# Altium schematic sheet Smart shoe_Power.SchDoc
size A; SheetNumber: 2; SheetTotal: 3
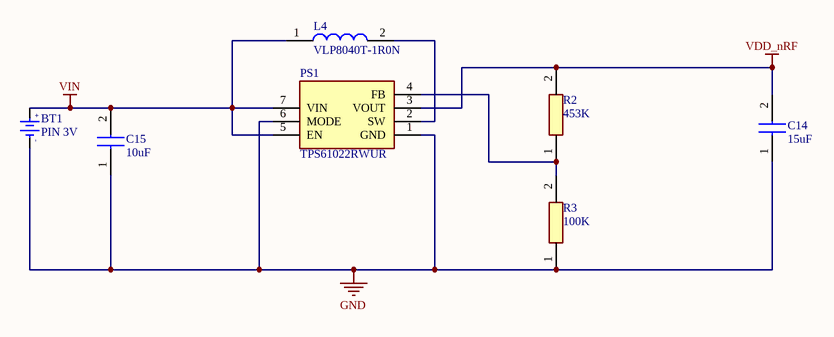
[diagram p0: Smart shoe_Power.SchDoc]

## Parts
BT1  PIN 3V  [PIN3V]
C14  15uF  [CAPC2012X145N]
C15  10uF  [CAPC2012X145N]
L4  VLP8040T-1R0N  [VLP8040T_1]
PS1  TPS61022RWUR  [TPS61022RWUR]
R2  453K  [RESC1005X40N]
R3  100K  [RESC1005X40N]

## Nets
GND: BT1.2(GND) C14.1 C15.1 PS1.1(GND) PS1.6(MODE) R3.1
VDD_nRF: C14.2 PS1.3(VOUT) R2.2
VIN: BT1.1(+3V) C15.2 L4.1 PS1.5(EN) PS1.7(VIN)
NetL4_2: L4.2 PS1.2(SW)
NetPS1_4: PS1.4(FB) R2.1 R3.2

## Notes on the sheet
- (in symbol PIN 3V) +; -

## Library data of the parts
BT1 = PIN 3V: Battery 3VDC; Value: PIN 3V
C14 = C2012X5R1V156M125AC: Capacitor; Manufacturer_Name: TDK; Datasheet Link: https://product.tdk.com/en/search/list#pn=C1608C0G1E103J080AA&site=FBNXDO0R&charset=UTF-8&group=tdk_pdc_en&design=producttdkcom-en&fromsyncsearch=1&_l=20&_p=1&_c=part_no-part_no&_d=667; Height: 0.75mm; Manufacturer_Part_Number: C2012X5R1V156M125AC; Mouser Part Number: 810-C2012X5R1V156M1C; Mouser Price/Stock: https://www.mouser.co.uk/ProductDetail/TDK/C2012X5R1V156M125AC?qs=xLDY6iXSiQZGpZ5eDP6b8w%3D%3D; Arrow Part Number: C2012X5R1V156M125AC; Arrow Price/Stock: https://www.arrow.com/en/products/c2012x5r1v156m125ac/tdk?region=nac
C15 = C0805C106K8PACTU: Capacitor; Manufacturer_Name: Kemet; Datasheet Link: https://www.arrow.com/en/products/c0805c106k8pactu/kemet-corporation; Height: 1.4mm; Manufacturer_Part_Number: C0805C106K8PACTU; Mouser Part Number: 80-C0805C106K8P; Mouser Price/Stock: https://www.mouser.co.uk/ProductDetail/KEMET/C0805C106K8PACTU?qs=Zpyg6gQUYs39C21BeavaKA%3D%3D; Arrow Part Number: C0805C106K8PACTU; Arrow Price/Stock: https://www.arrow.com/en/products/c0805c106k8pactu/kemet-corporation
L4 = VLP8040T-1R0N: Inductor; Manufacturer_Name: TDK; Datasheet Link: http://www.mouser.com/ds/2/400/nductor_commercial_power_vlp8040_en-952627.pdf; Manufacturer_Part_Number: VLP8040T-1R0N; Mouser Part Number: 810-VLP8040T-1R0N; Mouser Price/Stock: https://www.mouser.co.uk/ProductDetail/TDK/VLP8040T-1R0N?qs=uxmvvYJjMIuWRhSk5I768Q%3D%3D; Arrow Part Number: VLP8040T-1R0N; Arrow Price/Stock: https://www.arrow.com/en/products/vlp8040t-1r0n/tdk
PS1 = TPS61022RWUR: Power Supply; Manufacturer_Name: Texas Instruments; Datasheet Link: http://www.ti.com/lit/gpn/TPS61022; Height: 1mm; Manufacturer_Part_Number: TPS61022RWUR; Mouser Part Number: 595-TPS61022RWUR; Mouser Price/Stock: https://www.mouser.co.uk/ProductDetail/Texas-Instruments/TPS61022RWUR?qs=vLWxofP3U2zlxrk4cD0iFA%3D%3D; Arrow Part Number: TPS61022RWUR; Arrow Price/Stock: https://www.arrow.com/en/products/tps61022rwur/texas-instruments?region=nac
R2 = CRCW0402453KFKED: Resistor; Manufacturer_Name: Vishay; Datasheet Link: http://www.vishay.com/docs/20035/dcrcwe3.pdf; Height: 0.4mm; Manufacturer_Part_Number: CRCW0402453KFKED; Mouser Part Number: 71-CRCW0402-453K-E3; Mouser Price/Stock: https://www.mouser.co.uk/ProductDetail/Vishay-Dale/CRCW0402453KFKED?qs=rzhQWu8UUS1a9YBNTq1G%2FA%3D%3D; Arrow Part Number: CRCW0402453KFKED; Arrow Price/Stock: https://www.arrow.com/en/products/crcw0402453kfked/vishay
R3 = CRCW0402100KFKEDHP: Resistor; Manufacturer_Name: Vishay; Datasheet Link: http://www.vishay.com/docs/20035/dcrcwe3.pdf; Height: 0.4mm; Manufacturer_Part_Number: CRCW0402100KFKEDHP; Mouser Part Number: 71-CRCW0402100KFKEDH; Mouser Price/Stock: https://www.mouser.co.uk/ProductDetail/Vishay-Dale/CRCW0402100KFKEDHP?qs=k2%2FDWSARqgGFakjlJe4Ejw%3D%3D; Arrow Part Number: CRCW0402100KFKEDHP; Arrow Price/Stock: https://www.arrow.com/en/products/crcw0402100kfkedhp/vishay?region=nac